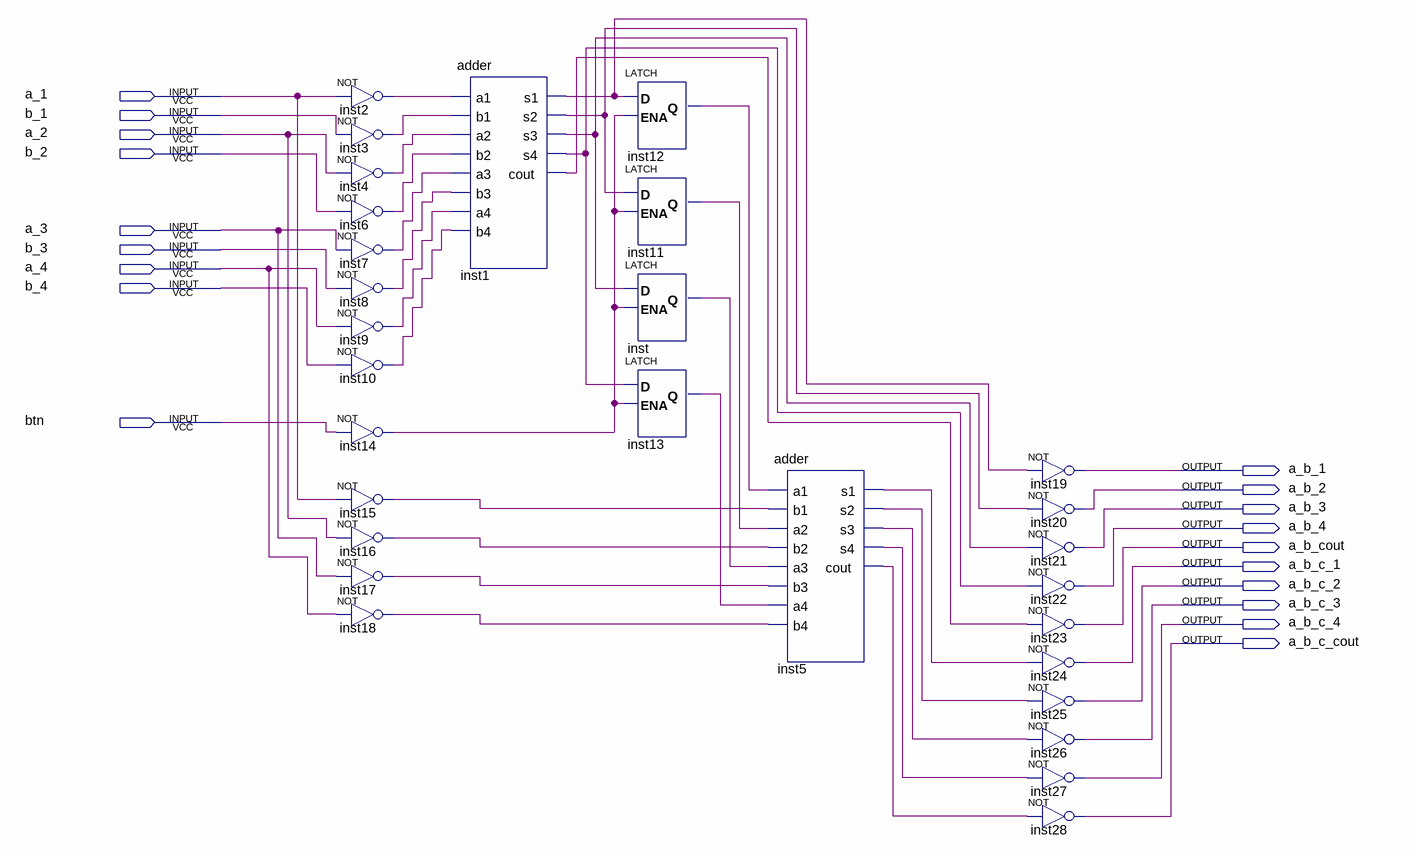
[diagram p0: schematic sheet]
// Quartus schematic lab6.bdf as structural Verilog: 29 symbols, 19 pins
module lab6 (
  input  a_1,
  input  b_1,
  input  a_2,
  input  b_2,
  input  a_3,
  input  b_3,
  input  a_4,
  input  b_4,
  input  btn,
  output a_b_1,
  output a_b_2,
  output a_b_3,
  output a_b_4,
  output a_b_cout,
  output a_b_c_1,
  output a_b_c_2,
  output a_b_c_3,
  output a_b_c_4,
  output a_b_c_cout
);

  wire inst1_cout, inst1_s1, inst1_s2, inst1_s3, inst1_s4, inst2_out, inst3_out, inst4_out, inst5_cout,
       inst5_s1, inst5_s2, inst5_s3, inst5_s4, inst6_out, inst7_out, inst8_out, inst9_out, inst10_out,
       inst11_q, inst12_q, inst13_q, inst14_out, inst15_out, inst16_out, inst17_out, inst18_out, inst_q;

  not inst2 (inst2_out, a_1);
  not inst3 (inst3_out, b_1);
  not inst4 (inst4_out, a_2);
  not inst6 (inst6_out, b_2);
  not inst7 (inst7_out, a_3);
  not inst8 (inst8_out, b_3);
  not inst9 (inst9_out, a_4);
  not inst10 (inst10_out, b_4);
  not inst14 (inst14_out, btn);
  not inst15 (inst15_out, a_1);
  not inst16 (inst16_out, a_2);
  not inst17 (inst17_out, a_3);
  not inst18 (inst18_out, a_4);
  adder inst1 (
    .a1(inst2_out), .b1(inst3_out), .a2(inst4_out), .b2(inst6_out), .a3(inst7_out), .b3(inst8_out),
    .a4(inst9_out), .b4(inst10_out), .s1(inst1_s1), .s2(inst1_s2), .s3(inst1_s3), .s4(inst1_s4),
    .cout(inst1_cout));
  LATCH inst12 (.D(inst1_s1), .ENA(inst14_out), .Q(inst12_q));
  LATCH inst11 (.D(inst1_s2), .ENA(inst14_out), .Q(inst11_q));
  LATCH inst (.D(inst1_s3), .ENA(inst14_out), .Q(inst_q));
  LATCH inst13 (.D(inst1_s4), .ENA(inst14_out), .Q(inst13_q));
  adder inst5 (
    .a1(inst12_q), .b1(inst15_out), .a2(inst11_q), .b2(inst16_out), .a3(inst_q), .b3(inst17_out),
    .a4(inst13_q), .b4(inst18_out), .s1(inst5_s1), .s2(inst5_s2), .s3(inst5_s3), .s4(inst5_s4),
    .cout(inst5_cout));
  not inst19 (a_b_1, inst1_s1);
  not inst20 (a_b_2, inst1_s2);
  not inst21 (a_b_3, inst1_s3);
  not inst22 (a_b_4, inst1_s4);
  not inst23 (a_b_cout, inst1_cout);
  not inst24 (a_b_c_1, inst5_s1);
  not inst25 (a_b_c_2, inst5_s2);
  not inst26 (a_b_c_3, inst5_s3);
  not inst27 (a_b_c_4, inst5_s4);
  not inst28 (a_b_c_cout, inst5_cout);
endmodule
